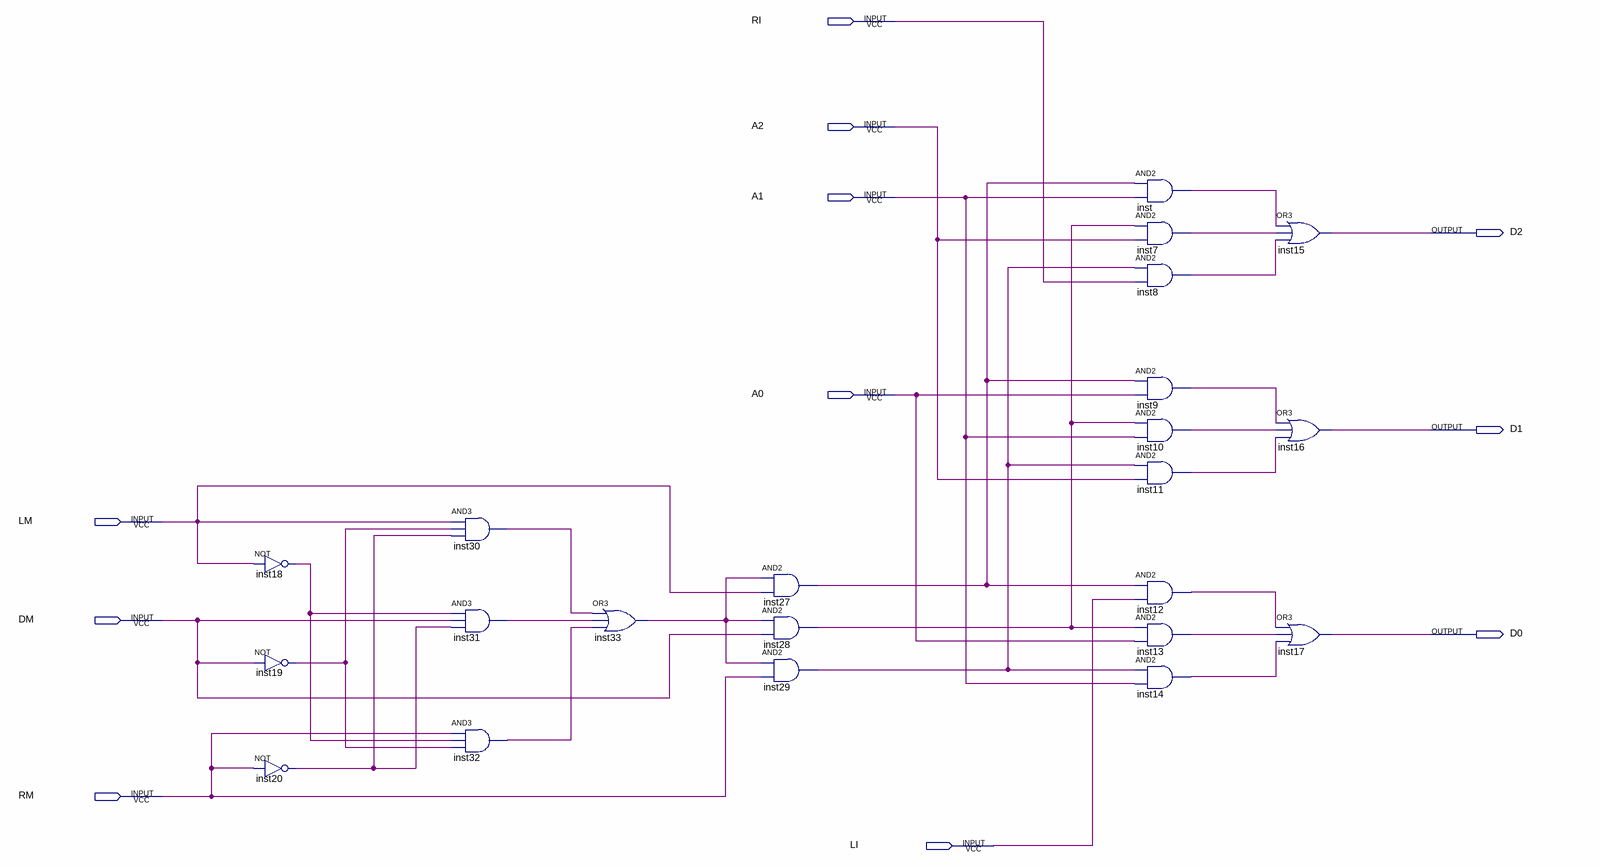
[diagram p0: schematic sheet]
// Quartus schematic shifter-3.bdf as structural Verilog: 22 symbols, 11 pins
module \shifter-3  (
  input  RI,
  input  A2,
  input  A1,
  input  A0,
  input  LM,
  input  DM,
  input  RM,
  input  LI,
  output D2,
  output D1,
  output D0
);

  wire inst7_out, inst8_out, inst9_out, inst10_out, inst11_out, inst12_out, inst13_out, inst14_out,
       inst18_out, inst19_out, inst20_out, inst27_out, inst28_out, inst29_out, inst30_out, inst31_out,
       inst32_out, inst33_out, inst_out;

  not inst18 (inst18_out, LM);
  not inst19 (inst19_out, DM);
  not inst20 (inst20_out, RM);
  and inst30 (inst30_out, LM, inst19_out, inst20_out);
  and inst31 (inst31_out, inst18_out, DM, inst20_out);
  and inst32 (inst32_out, RM, inst18_out, inst19_out);
  or inst33 (inst33_out, inst30_out, inst31_out, inst32_out);
  and inst27 (inst27_out, inst33_out, LM);
  and inst28 (inst28_out, inst33_out, DM);
  and inst29 (inst29_out, inst33_out, RM);
  and inst (inst_out, inst27_out, A1);
  and inst7 (inst7_out, inst28_out, A2);
  and inst8 (inst8_out, inst29_out, RI);
  and inst9 (inst9_out, inst27_out, A0);
  and inst10 (inst10_out, inst28_out, A1);
  and inst11 (inst11_out, inst29_out, A2);
  and inst12 (inst12_out, inst27_out, LI);
  and inst13 (inst13_out, inst28_out, A0);
  and inst14 (inst14_out, inst29_out, A1);
  or inst15 (D2, inst_out, inst7_out, inst8_out);
  or inst16 (D1, inst9_out, inst10_out, inst11_out);
  or inst17 (D0, inst12_out, inst13_out, inst14_out);
endmodule
